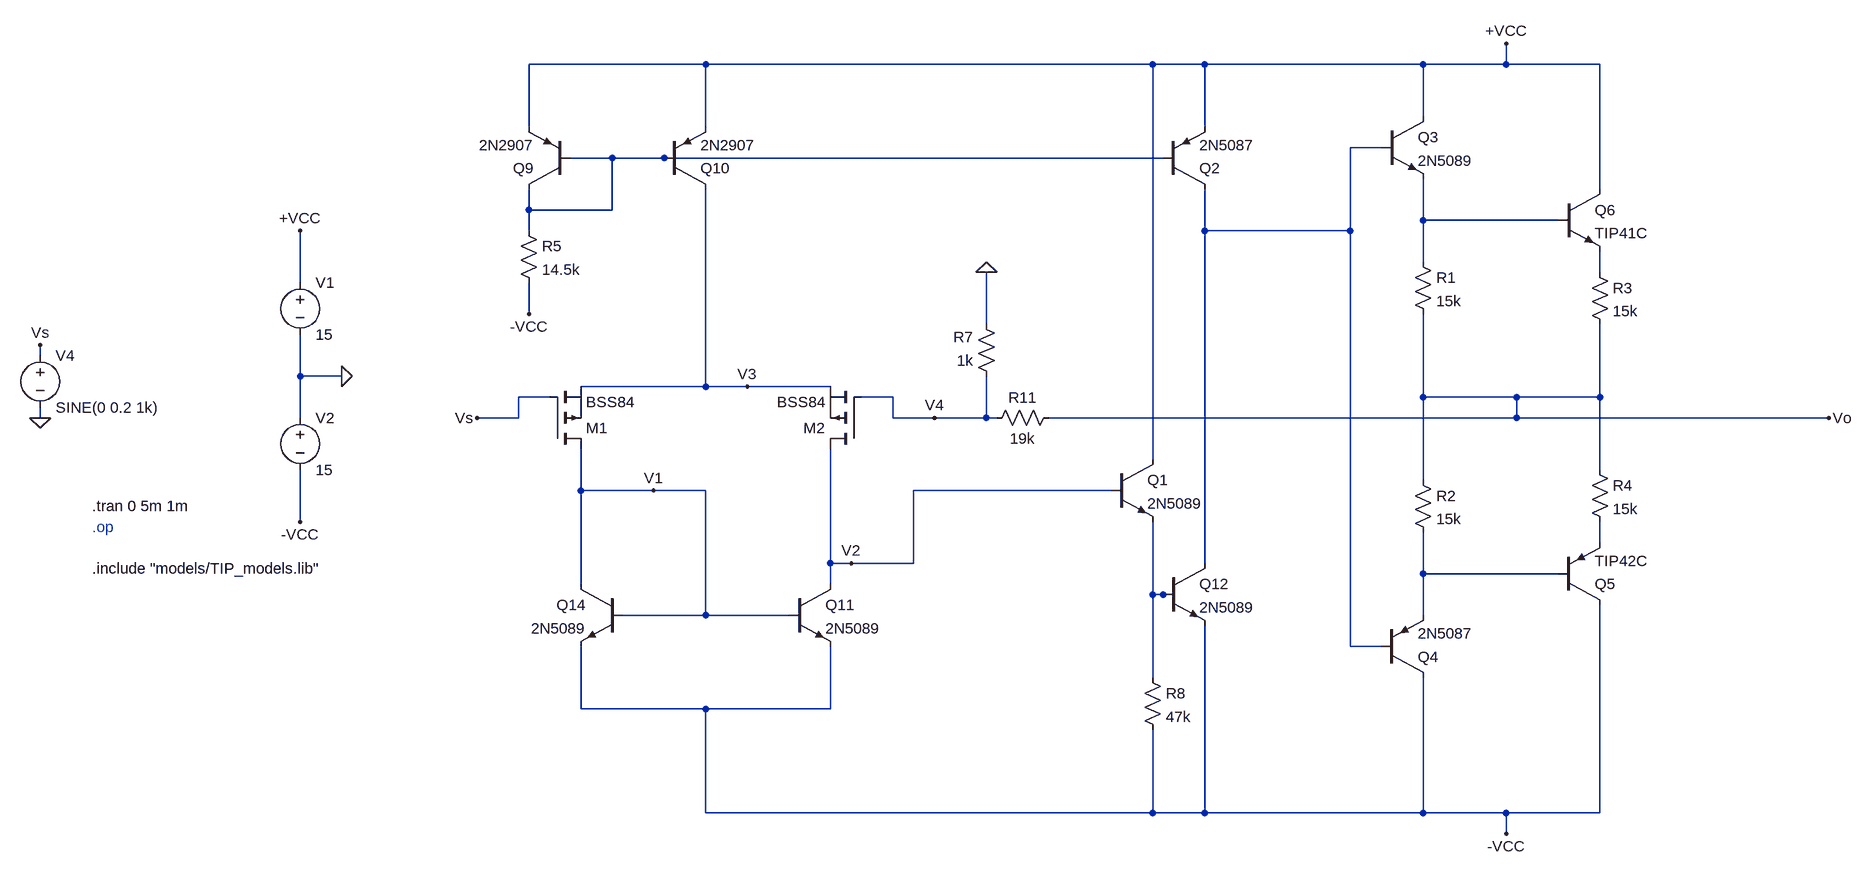
[diagram p0: schematic AmplificadorOperacionalCompleto_v4.asc]
AmplificadorOperacionalCompleto_v4.asc, the LTspice schematic file:
Version 4.1
SHEET 1 4688 1700
WIRE 1008 128 736 128
WIRE 1696 128 1008 128
WIRE 1776 128 1696 128
WIRE 2112 128 1776 128
WIRE 2240 128 2240 96
WIRE 2240 128 2112 128
WIRE 2384 128 2240 128
WIRE 2112 208 2112 128
WIRE 736 224 736 128
WIRE 1008 224 1008 128
WIRE 1776 224 1776 128
WIRE 2048 256 2000 256
WIRE 864 272 800 272
WIRE 944 272 864 272
WIRE 1712 272 944 272
WIRE 2384 320 2384 128
WIRE 736 352 736 320
WIRE 864 352 864 272
WIRE 864 352 736 352
WIRE 2112 368 2112 304
WIRE 2320 368 2112 368
WIRE 736 384 736 352
WIRE 1776 384 1776 320
WIRE 2000 384 2000 256
WIRE 2000 384 1776 384
WIRE 2112 432 2112 368
WIRE 2384 448 2384 416
WIRE 384 464 384 384
WIRE 736 512 736 464
WIRE 1440 528 1440 448
WIRE -16 576 -16 560
WIRE 384 608 384 544
WIRE 448 608 384 608
WIRE 1008 624 1008 320
WIRE 1008 624 816 624
WIRE 1072 624 1008 624
WIRE 1200 624 1072 624
WIRE 768 640 720 640
WIRE 1296 640 1248 640
WIRE 2112 640 2112 512
WIRE 2256 640 2112 640
WIRE 2384 640 2384 528
WIRE 2384 640 2256 640
WIRE -16 672 -16 656
WIRE 384 672 384 608
WIRE 720 672 720 640
WIRE 720 672 656 672
WIRE 1296 672 1296 640
WIRE 1360 672 1296 672
WIRE 1440 672 1440 608
WIRE 1440 672 1360 672
WIRE 1456 672 1440 672
WIRE 2256 672 2256 640
WIRE 2256 672 1536 672
WIRE 2736 672 2256 672
WIRE 1696 736 1696 128
WIRE 2384 752 2384 640
WIRE 2112 768 2112 640
WIRE 816 784 816 720
WIRE 928 784 816 784
WIRE 1008 784 928 784
WIRE 1632 784 1328 784
WIRE 384 832 384 752
WIRE 2384 864 2384 832
WIRE 1200 896 1200 720
WIRE 1232 896 1200 896
WIRE 1328 896 1328 784
WIRE 1328 896 1232 896
WIRE 1776 896 1776 384
WIRE 2112 912 2112 848
WIRE 2320 912 2112 912
WIRE 816 928 816 784
WIRE 1200 928 1200 896
WIRE 1696 944 1696 832
WIRE 1712 944 1696 944
WIRE 1728 944 1712 944
WIRE 1008 976 1008 784
WIRE 1008 976 880 976
WIRE 1136 976 1008 976
WIRE 2112 976 2112 912
WIRE 2000 1024 2000 384
WIRE 2048 1024 2000 1024
WIRE 1696 1072 1696 944
WIRE 816 1120 816 1024
WIRE 1008 1120 816 1120
WIRE 1200 1120 1200 1024
WIRE 1200 1120 1008 1120
WIRE 1008 1280 1008 1120
WIRE 1696 1280 1696 1152
WIRE 1696 1280 1008 1280
WIRE 1776 1280 1776 992
WIRE 1776 1280 1696 1280
WIRE 2112 1280 2112 1072
WIRE 2112 1280 1776 1280
WIRE 2240 1280 2112 1280
WIRE 2384 1280 2384 960
WIRE 2384 1280 2240 1280
WIRE 2240 1312 2240 1280
FLAG 384 384 +VCC
FLAG 384 832 -VCC
FLAG -16 560 Vs
FLAG -16 672 0
FLAG 448 608 0
FLAG 736 512 -VCC
FLAG 656 672 Vs
FLAG 2240 1312 -VCC
FLAG 2240 96 +VCC
FLAG 2736 672 Vo
FLAG 928 784 V1
FLAG 1232 896 V2
FLAG 1072 624 V3
FLAG 1360 672 V4
FLAG 1440 448 0
SYMBOL voltage 384 448 R0
WINDOW 123 0 0 Left 0
WINDOW 39 0 0 Left 0
SYMATTR InstName V1
SYMATTR Value 15
SYMBOL voltage 384 656 R0
WINDOW 123 0 0 Left 0
WINDOW 39 0 0 Left 0
SYMATTR InstName V2
SYMATTR Value 15
SYMBOL voltage -16 560 R0
WINDOW 123 0 0 Left 0
WINDOW 39 0 0 Left 0
SYMATTR InstName V4
SYMATTR Value SINE(0 0.2 1k)
SYMBOL res 720 368 R0
SYMATTR InstName R5
SYMATTR Value 14.5k
SYMBOL pnp 800 320 R180
SYMATTR InstName Q9
SYMATTR Value 2N2907
SYMBOL pnp 944 320 M180
SYMATTR InstName Q10
SYMATTR Value 2N2907
SYMBOL npn 1632 736 R0
SYMATTR InstName Q1
SYMATTR Value 2N5089
SYMBOL pnp 1712 320 M180
SYMATTR InstName Q2
SYMATTR Value 2N5087
SYMBOL pmos 768 720 M180
SYMATTR InstName M1
SYMATTR Value BSS84
SYMBOL pmos 1248 720 R180
SYMATTR InstName M2
SYMATTR Value BSS84
SYMBOL npn 2048 208 R0
SYMATTR InstName Q3
SYMATTR Value 2N5089
SYMBOL res 2096 416 R0
SYMATTR InstName R1
SYMATTR Value 15k
SYMBOL res 2096 752 R0
SYMATTR InstName R2
SYMATTR Value 15k
SYMBOL pnp 2048 1072 M180
SYMATTR InstName Q4
SYMATTR Value 2N5087
SYMBOL res 2368 432 R0
SYMATTR InstName R3
SYMATTR Value 15k
SYMBOL res 2368 736 R0
SYMATTR InstName R4
SYMATTR Value 15k
SYMBOL res 1552 656 R90
WINDOW 0 0 56 VBottom 2
WINDOW 3 32 56 VTop 2
SYMATTR InstName R11
SYMATTR Value 19k
SYMBOL npn 1136 928 R0
SYMATTR InstName Q11
SYMATTR Value 2N5089
SYMBOL npn 880 928 M0
SYMATTR InstName Q14
SYMATTR Value 2N5089
SYMBOL res 1456 624 R180
WINDOW 0 36 76 Left 2
WINDOW 3 36 40 Left 2
SYMATTR InstName R7
SYMATTR Value 1k
SYMBOL npn 1712 896 R0
SYMATTR InstName Q12
SYMATTR Value 2N5089
SYMBOL res 1680 1056 R0
SYMATTR InstName R8
SYMATTR Value 47k
SYMBOL pnp 2320 960 M180
SYMATTR InstName Q5
SYMATTR Value TIP42C
SYMBOL npn 2320 320 R0
SYMATTR InstName Q6
SYMATTR Value TIP41C
TEXT 64 808 Left 2 !.tran 0 5m 1m
TEXT 64 840 Left 2 ;.op
TEXT 64 904 Left 2 !.include "models/TIP_models.lib"

The netlist it stands for:
* AmplificadorOperacionalCompleto_v4.asc
V1 +VCC 0 15
V2 0 -VCC 15
V4 Vs 0 SINE(0 0.2 1k)
R5 N002 -VCC 14.5k
Q9 N002 N002 +VCC 0 2N2907
Q10 V3 N002 +VCC 0 2N2907
Q1 +VCC V2 N007 0 2N5089
Q2 N001 N002 +VCC 0 2N5087
M1 V1 Vs V3 V3 BSS84
M2 V2 V4 V3 V3 BSS84
Q3 +VCC N001 N003 0 2N5089
R1 N003 Vo 15k
R2 Vo N006 15k
Q4 -VCC N001 N006 0 2N5087
R3 N004 Vo 15k
R4 Vo N005 15k
R11 Vo V4 19k
Q11 V2 V1 -VCC 0 2N5089
Q14 V1 V1 -VCC 0 2N5089
R7 V4 0 1k
Q12 N001 N007 -VCC 0 2N5089
R8 N007 -VCC 47k
Q5 -VCC N006 N005 0 TIP42C
Q6 +VCC N003 N004 0 TIP41C
.model NPN NPN
.model PNP PNP
.lib standard.bjt
.model NMOS NMOS
.model PMOS PMOS
.lib standard.mos
.tran 0 5m 1m
* .op
.include "models/TIP_models.lib"
.backanno
.end